# Altium schematic sheet [04]-ADDITIONAL-BOM-PARTS.SchDoc: Additional BOM Parts
size A3; Ingenieur: Stephan Diel; Organization: Dr. Hönle AG; Address1: Lochhamer Schlag 1; Address2: 82166 Gräfelfing; Address3: Germany; Address4: www.hoenle.de; DocumentNumber: 4; Revision: e01; SheetNumber: 4; SheetTotal: 13; NavArtikelnummern: KPL 08xxxxx LP 08xxxxx
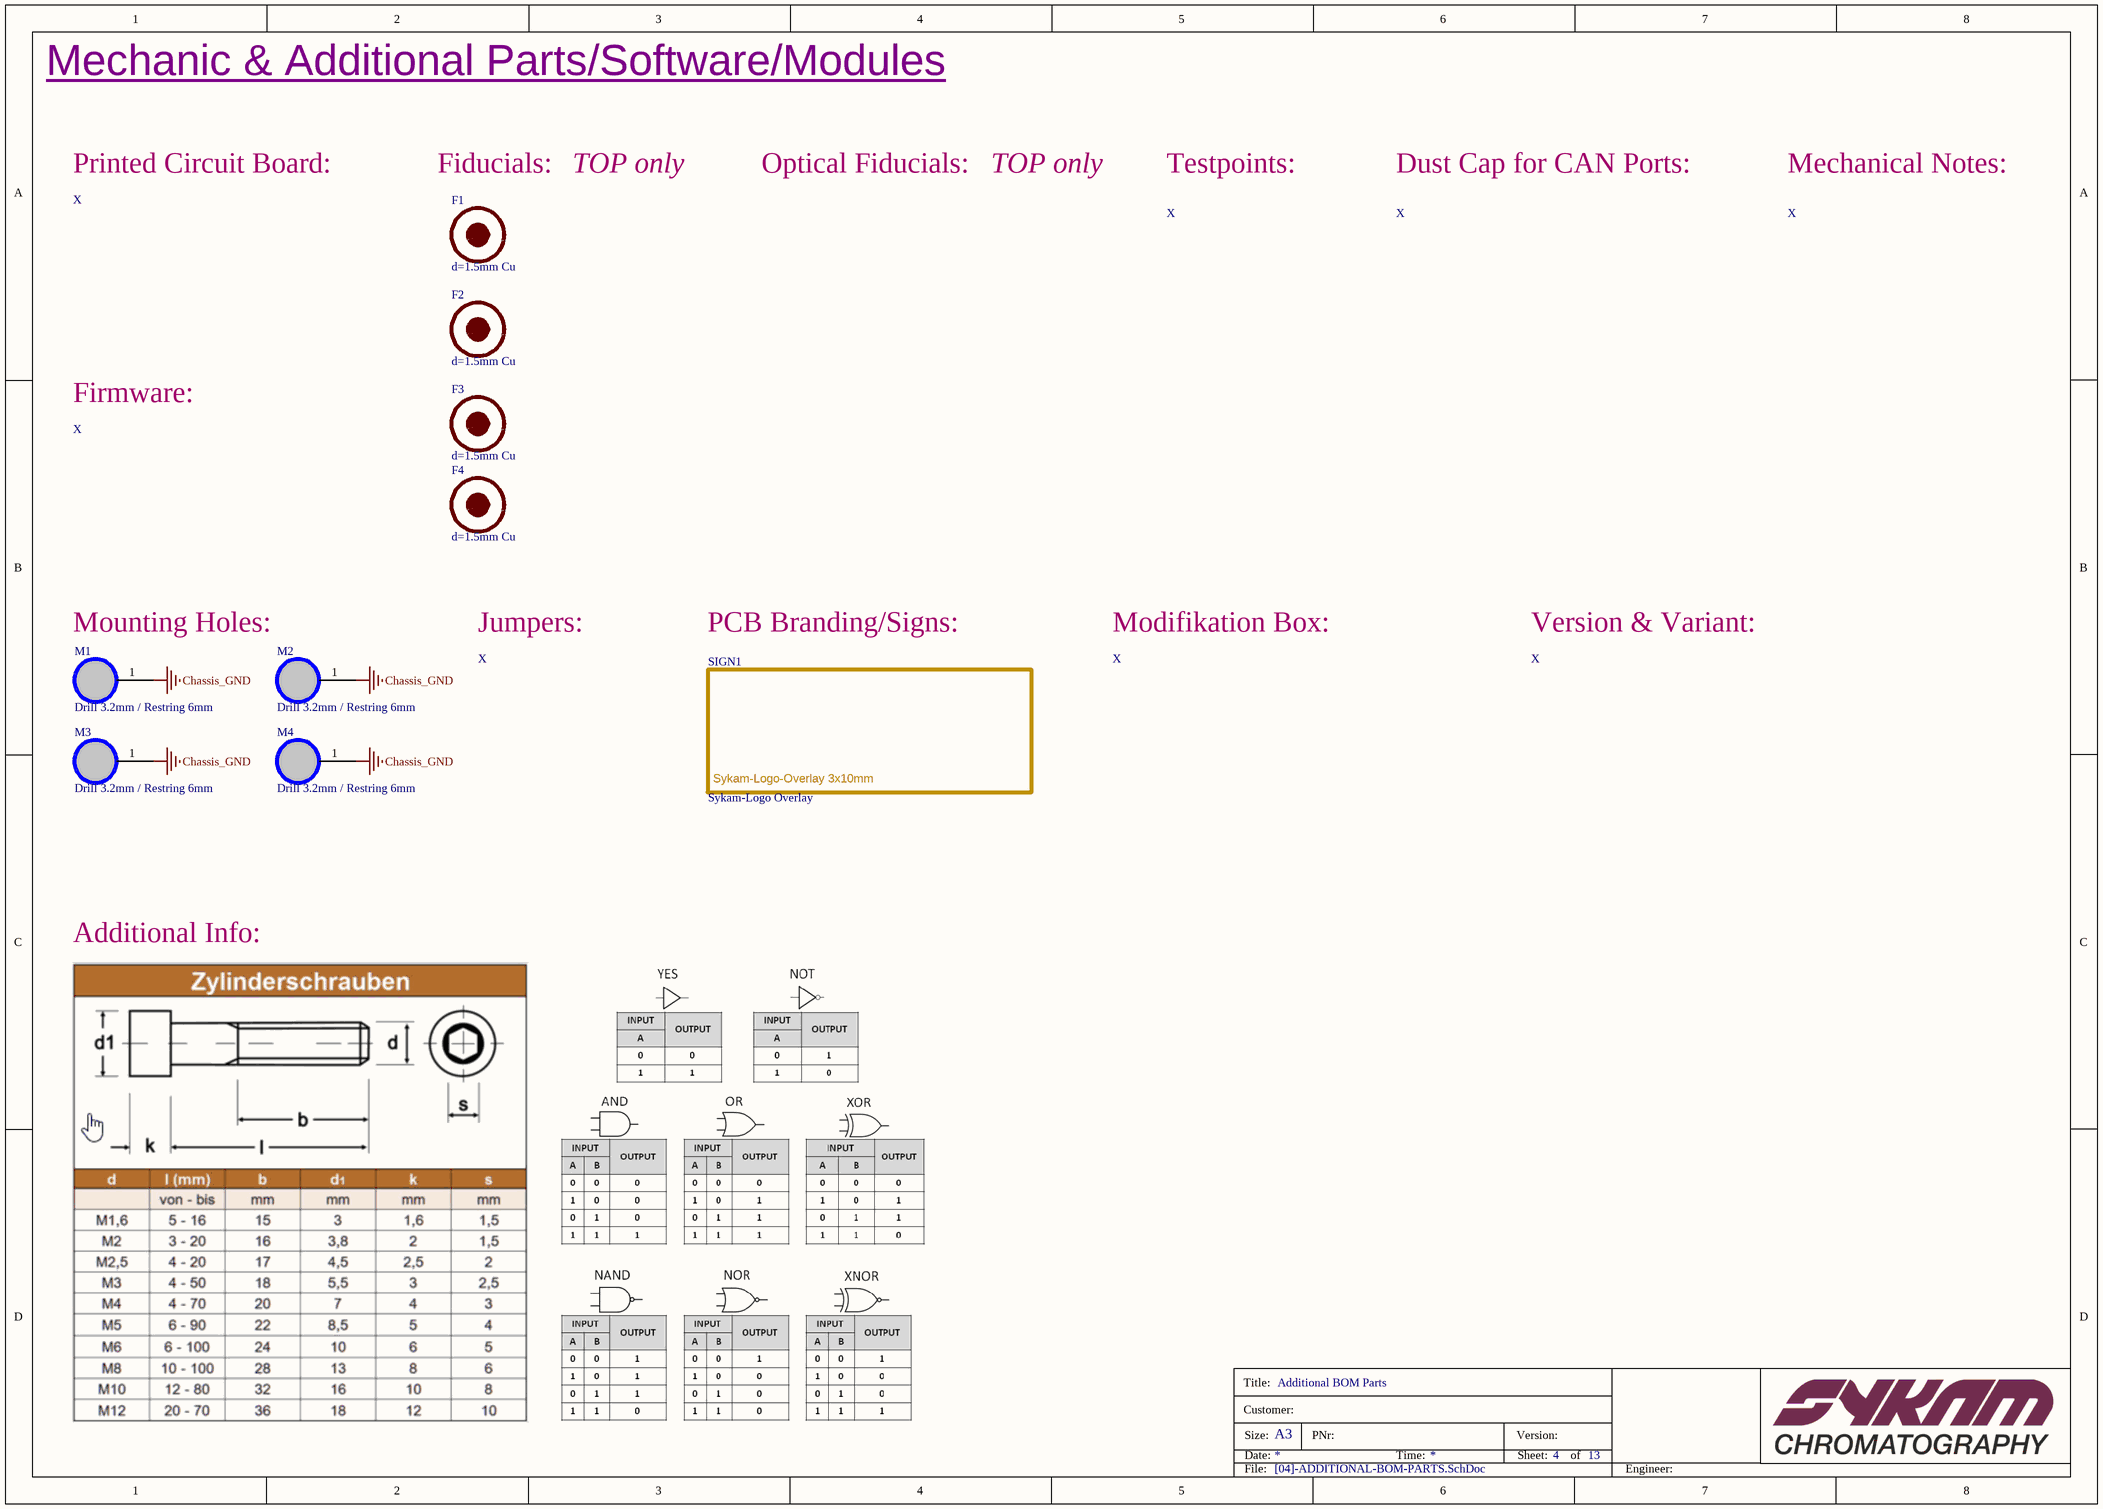
[diagram p0: [04]-ADDITIONAL-BOM-PARTS.SchDoc]

## Parts
F1  d=1.5mm Cu  [Fiducial_1]  (no BOM)
F2  d=1.5mm Cu  [Fiducial_1]  (no BOM)
F3  d=1.5mm Cu  [Fiducial_1]  (no BOM)
F4  d=1.5mm Cu  [Fiducial_1]  (no BOM)
M1  Drill 3.2mm / Restring 6mm  [Mountingholes_M3_ZylKS_Plated]  (no BOM)
M2  Drill 3.2mm / Restring 6mm  [Mountingholes_M3_ZylKS_Plated]  (no BOM)
M3  Drill 3.2mm / Restring 6mm  [Mountingholes_M3_ZylKS_Plated]  (no BOM)
M4  Drill 3.2mm / Restring 6mm  [Mountingholes_M3_ZylKS_Plated]  (no BOM)
SIGN1  Sykam-Logo Overlay  [Logo-Sykam_3x10mm]  (no BOM)

## Nets
Chassis_GND: M1.1 M2.1 M3.1 M4.1

## Notes on the sheet
- Mechanic & Additional Parts/Software/Modules
- Printed Circuit Board:
- Fiducials:
- TOP only
- Optical Fiducials:
- Testpoints:
- Dust Cap for CAN Ports:
- Mechanical Notes:
- X
- Firmware:
- Mounting Holes:
- Jumpers:
- PCB Branding/Signs:
- Modifikation Box:
- Version & Variant:
- Additional Info:
- Title:
- Customer:
- Size:
- Date:
- A3
- PNr:
- Time:
- Version:
- Sheet:
- of
- File:
- Engineer:
- (in symbol Logo-3x10mm) Sykam-Logo-Overlay 3x10mm

## Library data of the parts
F1-F4 = Fiducial_1,5mm: Fiducial Passermarke mit 1.5mm Druchmesser.
M1-M4 = Mountinghole_M3
SIGN1 = Logo-3x10mm: Sykam Logo im Overlay